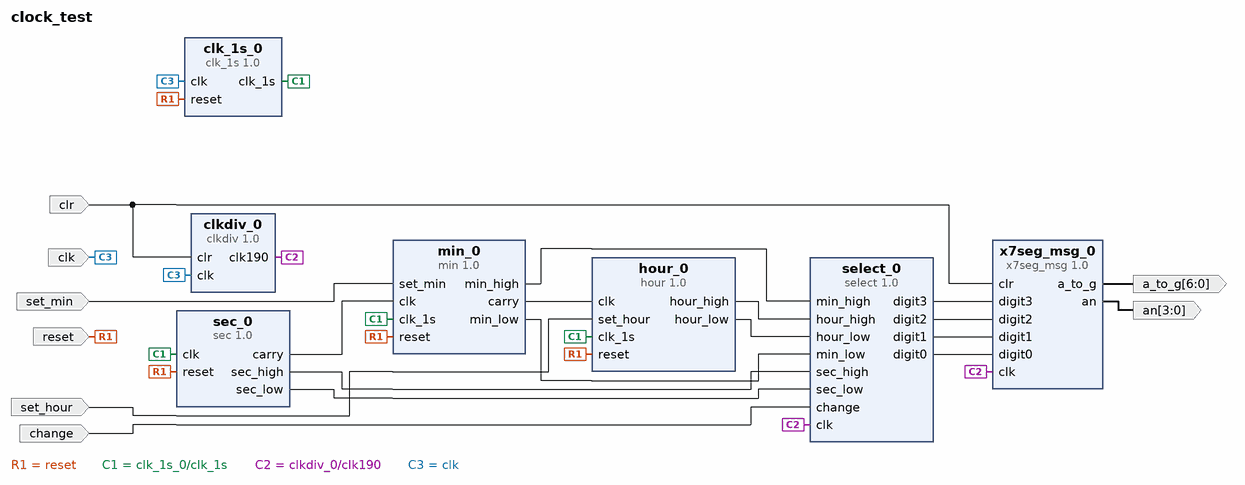
[diagram p0: block diagram of the top level]
# Vivado block design clock_test, xc7a35tcpg236-1, Vivado 2017.1
create_bd_design clock_test

create_bd_port -dir I -type clk clk
set_property -dict {CONFIG.FREQ_HZ 100000000} [get_bd_ports clk]
create_bd_port -dir I -type rst reset
create_bd_port -dir I clr
create_bd_port -dir I set_hour
create_bd_port -dir I set_min
create_bd_port -dir I change
create_bd_port -dir O -from 6 -to 0 a_to_g
create_bd_port -dir O -from 3 -to 0 an

create_bd_cell -type ip -vlnv xilinx.com:user:x7seg_msg:1.0 x7seg_msg_0
create_bd_cell -type ip -vlnv xilinx.com:user:clk_1s:1.0 clk_1s_0
create_bd_cell -type ip -vlnv xilinx.com:user:clkdiv:1.0 clkdiv_0
create_bd_cell -type ip -vlnv xilinx.com:user:hour:1.0 hour_0
create_bd_cell -type ip -vlnv xilinx.com:user:sec:1.0 sec_0
create_bd_cell -type ip -vlnv xilinx.com:user:min:1.0 min_0
create_bd_cell -type ip -vlnv xilinx.com:user:select:1.0 select_0

# ---- connections ----

connect_bd_net [get_bd_ports reset] [get_bd_pins clk_1s_0/reset] [get_bd_pins sec_0/reset] [get_bd_pins hour_0/reset] [get_bd_pins min_0/reset]
connect_bd_net [get_bd_pins clk_1s_0/clk_1s] [get_bd_pins hour_0/clk_1s] [get_bd_pins min_0/clk_1s] [get_bd_pins sec_0/clk]
connect_bd_net [get_bd_ports set_hour] [get_bd_pins hour_0/set_hour]
connect_bd_net [get_bd_ports set_min] [get_bd_pins min_0/set_min]
connect_bd_net [get_bd_pins clkdiv_0/clk190] [get_bd_pins x7seg_msg_0/clk] [get_bd_pins select_0/clk]
connect_bd_net [get_bd_pins sec_0/carry] [get_bd_pins min_0/clk]
connect_bd_net [get_bd_pins min_0/carry] [get_bd_pins hour_0/clk]
connect_bd_net [get_bd_ports clr] [get_bd_pins x7seg_msg_0/clr] [get_bd_pins clkdiv_0/clr]
connect_bd_net [get_bd_ports clk] [get_bd_pins clkdiv_0/clk] [get_bd_pins clk_1s_0/clk]
connect_bd_net [get_bd_ports change] [get_bd_pins select_0/change]
connect_bd_net [get_bd_pins hour_0/hour_high] [get_bd_pins select_0/hour_high]
connect_bd_net [get_bd_pins hour_0/hour_low] [get_bd_pins select_0/hour_low]
connect_bd_net [get_bd_pins min_0/min_high] [get_bd_pins select_0/min_high]
connect_bd_net [get_bd_pins min_0/min_low] [get_bd_pins select_0/min_low]
connect_bd_net [get_bd_pins sec_0/sec_high] [get_bd_pins select_0/sec_high]
connect_bd_net [get_bd_pins sec_0/sec_low] [get_bd_pins select_0/sec_low]
connect_bd_net [get_bd_pins select_0/digit3] [get_bd_pins x7seg_msg_0/digit3]
connect_bd_net [get_bd_pins select_0/digit2] [get_bd_pins x7seg_msg_0/digit2]
connect_bd_net [get_bd_pins select_0/digit1] [get_bd_pins x7seg_msg_0/digit1]
connect_bd_net [get_bd_pins select_0/digit0] [get_bd_pins x7seg_msg_0/digit0]
connect_bd_net [get_bd_pins x7seg_msg_0/a_to_g] [get_bd_ports a_to_g]
connect_bd_net [get_bd_pins x7seg_msg_0/an] [get_bd_ports an]

validate_bd_design
save_bd_design
